# EasyEDA Pro project ProPrj_赛博沙漏彩砂版二代（完全开源）_2025-03-31.epro, board 主控3030
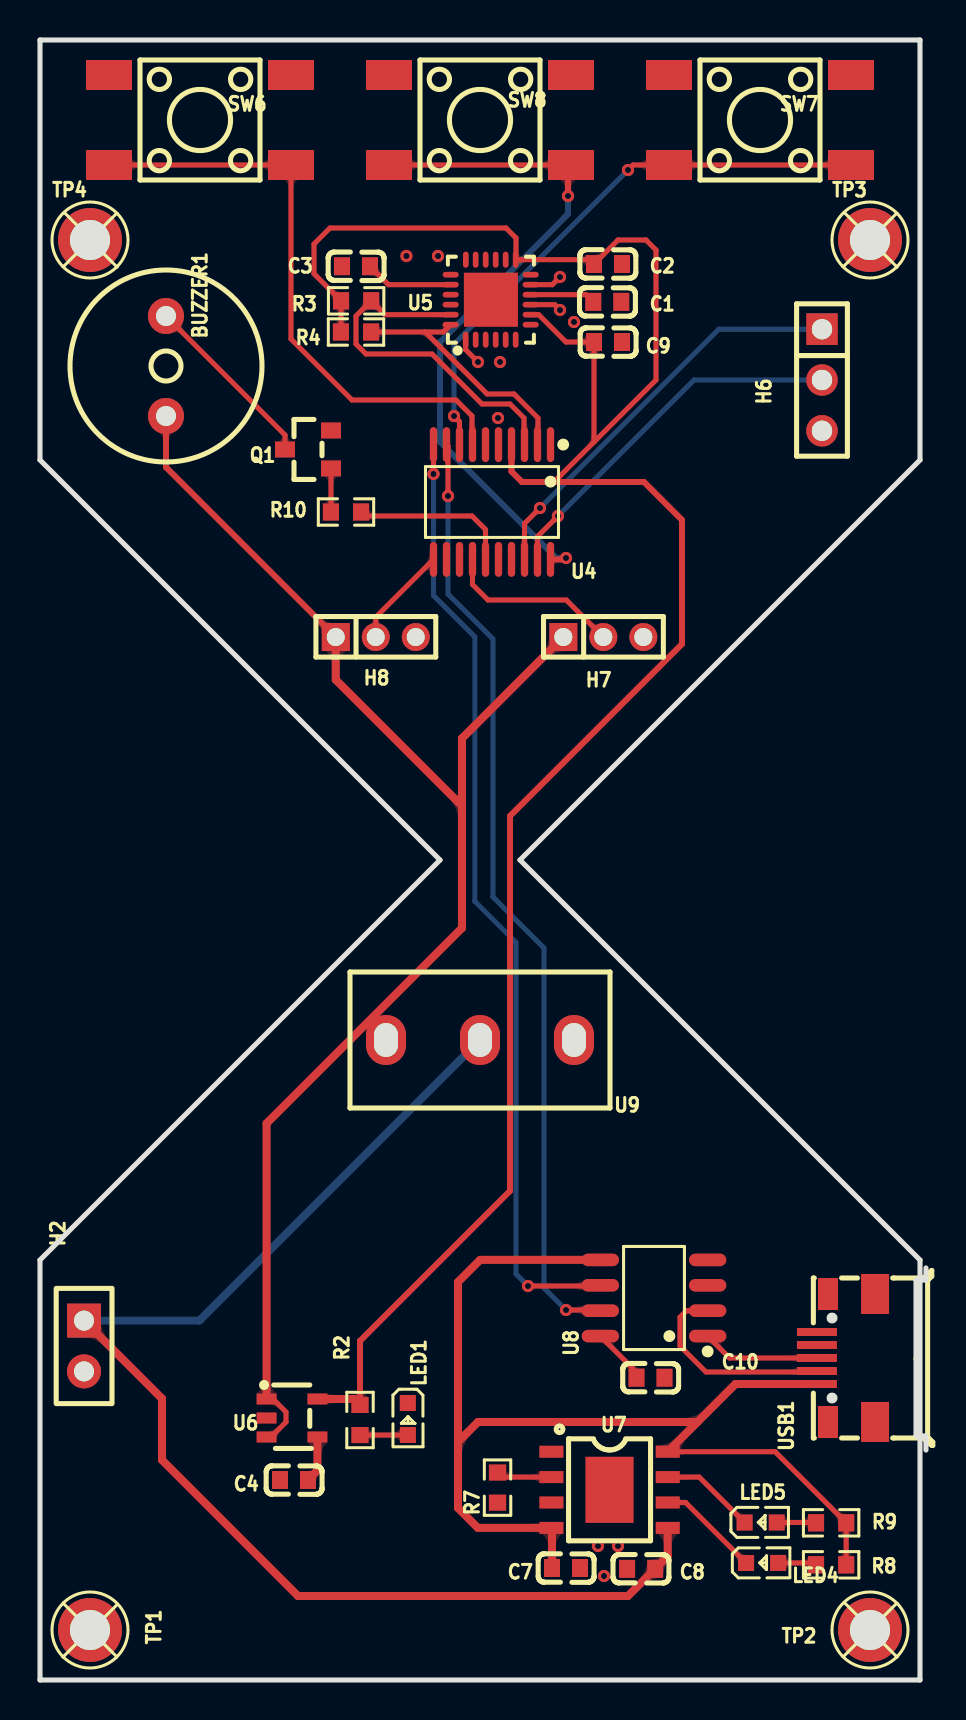
[diagram p2: board, top side]
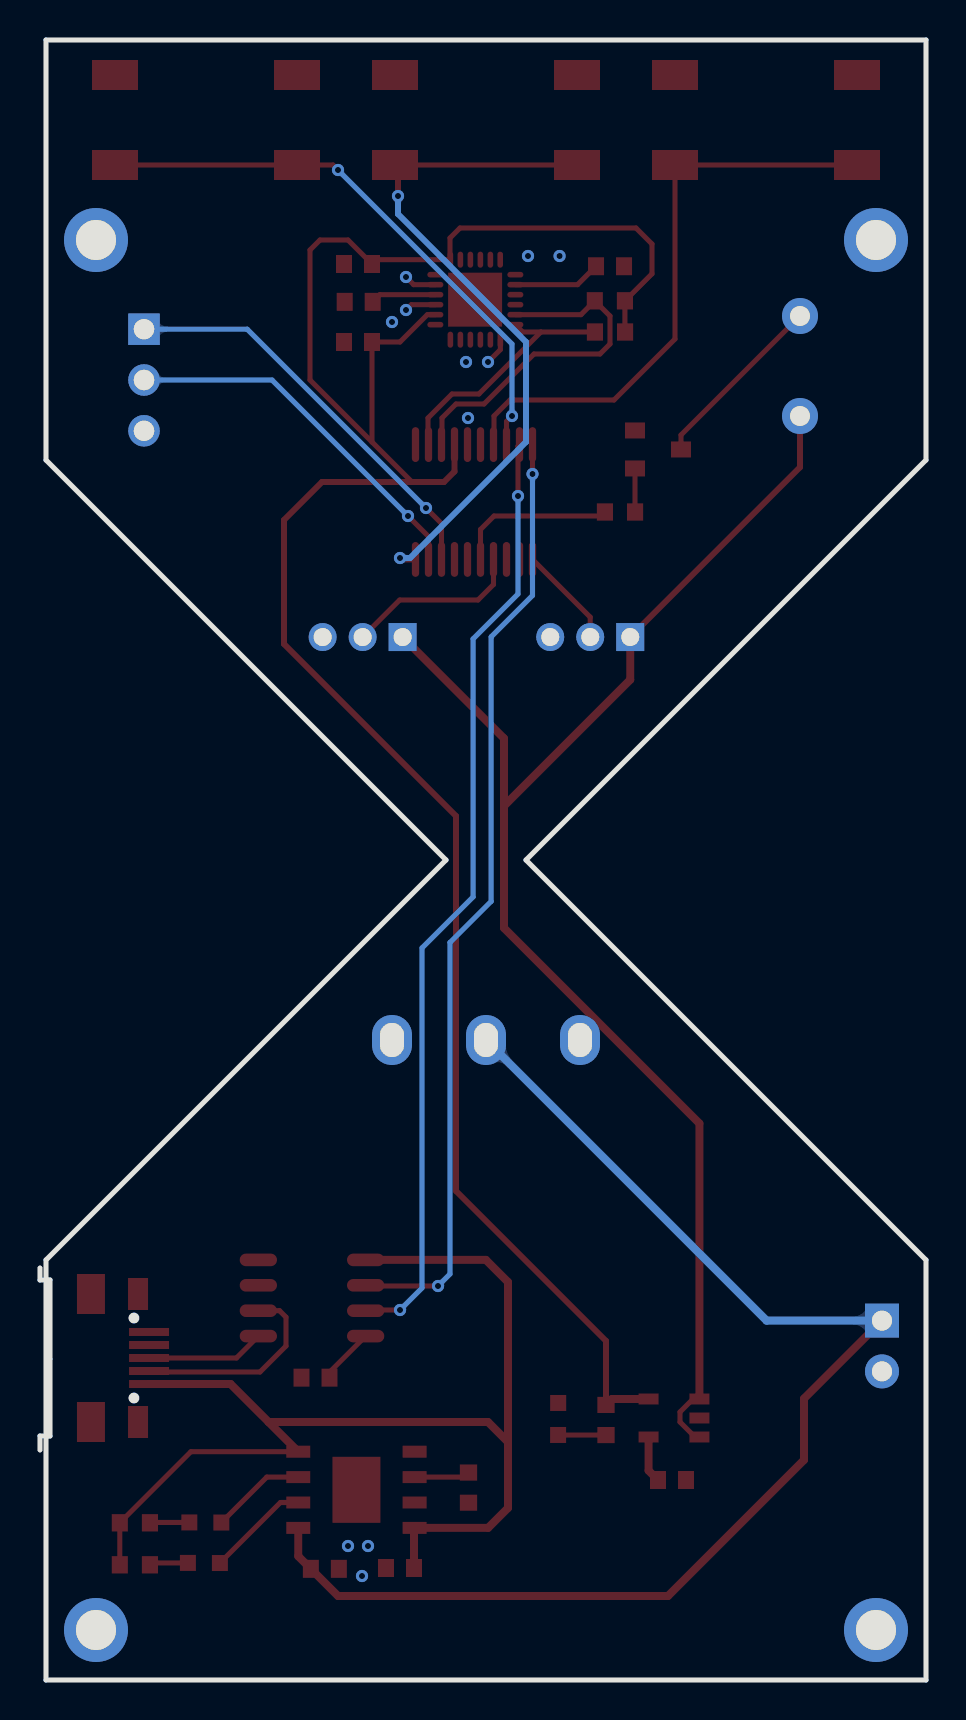
[diagram p3: board, bottom side, seen from below]

Outline 44.3 x 82 mm; copper layers: Top Layer, Bottom Layer. Coordinates in mm from the lower left corner of the outline.
Outline path: 0,82 0,61 20,41 0,21 0,0 44,0 44,21 24,41 44,61 44,82 0,82
Stack: Top Layer 0.035mm / Dielectric1 1.51mm FR4 er 4.5 / Bottom Layer 0.035mm

## Design rules (mm)
template: JLCPCB Capability(Two Layers Board)
spacing copperThickness1oz (default): track to track 0.102, other pairs 0.152 to 0.3
spacing copperThickness2oz: track to track 0.203, other pairs 0.152 to 0.3
track width copperThickness1oz (default): min 0.127, default 0.254, max 2.54
track width copperThickness2oz: min 0.203, default 0.254, max 2.54
differential pair differentialPair (default): width min 0.127, default 0.254, max 2.54; gap min 0.152, default 0.152
via viaSize (default): diameter min 0.5, default 0.61, max 10; hole min 0.3, default 0.305, max 6.3

## Placement (name value [footprint] x y rotation side)
BUZZER1  3000Hz  [BUZ-TH_BD9.6-P5.00-D0.7-FD]  6.3 65.7 90 top
C1  100nF  [C0603]  28.37 68.91 180 top
C2  100nF  [C0603]  28.4 70.8 0 top
C3  2.2nF  [C0603]  15.8 70.69 180 top
C4  470pF  [C0603]  12.7 10 180 top
C7  10uF  [C0603]  26.3 5.6 180 top
C8  10uF  [C0603]  30.06 5.56 0 top
C9  100nF  [C0603]  28.4 66.9 180 top
C10  100nF  [C0603]  30.53 15.12 180 top
H2  -  [HDR-TH_2P-P2.54-V-F]  2.2 16.7 270 top
H6  -  [HDR-TH_3P-P2.54-V-F]  39.1 65 270 top
H7  PZ200-1-03-Z  [HDR-TH_3P-P2.00-V-M]  28.17 52.15 0 top
H8  PZ200-1-03-Z  [HDR-TH_3P-P2.00-V-M]  16.79 52.15 0 top
LED1  -  [LED_0603]  18.4 13 270 top
LED4  -  [LED_0603]  36.16 5.86 0 top
LED5  -  [LED_0603]  36.08 7.88 0 top
Q1  -  [S8050_SOT-23]  13.4 61.4 0 top
R2  1K  [R0603]  16 13 270 top
R3  10K  [R0603]  15.81 68.96 180 top
R4  10K  [R0603]  15.8 67.4 180 top
R7  1.2K  [R0603]  22.88 9.62 90 top
R8  10K  [R0603]  39.56 5.76 180 top
R9  10K  [R0603]  39.56 7.86 180 top
R10  1K  [R0603]  15.3 58.4 180 top
SW6  -  [SW-SMD_4P-L6.0-W6.0-P4.50-LS9.0-2]  8 78 180 top
SW7  -  [SW-SMD_4P-L6.0-W6.0-P4.50-LS9.0-2]  36 78 180 top
SW8  -  [SW-SMD_4P-L6.0-W6.0-P4.50-LS9.0-2]  22 78 180 top
TP1  -  [m2螺丝]  2.5 2.5 270 top
TP2  -  [m2螺丝]  41.5 2.5 0 top
TP3  -  [m2螺丝]  41.5 72 0 top
TP4  -  [m2螺丝]  2.5 72 0 top
U4  STM32G030F6P6TR  [TSSOP-20_L6.5-W4.4-P0.65-LS6.4-BL]  22.6 58.9 180 top
U5  MPU-6050  [QFN-24_L4.0-W4.0-P0.50-BL-EP2.7]  22.53 69.02 0 top
U6  MIC5219YM5-TR  [SOT-23-5_L3.0-W1.7-P0.95-LS2.8-TL]  12.6 13.1 0 top
U7  TP4056  [ESOP-8_L4.9-W3.9-P1.27-LS6.0-BL-EP]  28.48 9.51 270 top
U8  CH340N  [SOP-8_L4.9-W3.9-P1.27-LS6.0-BL]  30.7 19.1 90 top
U9  SS-12D10G8R  [SW-TH_XKB_SS-12D10G8R]  22 32 180 top
USB1  MicroQTJ  [MICRO-USB-SMD_MICROQTJ]  40.3 16.1 90 top

## Footprints (pads in the part's own frame, mm; a bottom-side part is the same pattern mirrored in y, then rotated)
BUZ-TH_BD9.6-P5.00-D0.7-FD
  round 1.8 hole 1: 1(-2.5,0) 2(2.5,0)
C0603
  rect 0.8x0.9 smd: 1(-0.7,0) 2(0.7,0)
ESOP-8_L4.9-W3.9-P1.27-LS6.0-BL-EP
  rect 0.6x1.2 smd: 1(-1.905,-2.909) 2(-0.635,-2.909) 3(0.635,-2.909) 4(1.905,-2.909) 5(1.905,2.909) 6(0.635,2.909) 7(-0.635,2.909) 8(-1.905,2.909)
  rect 3.3x2.4 smd: 9(0,0)
HDR-TH_2P-P2.54-V-F
  rect 1.7x1.7 hole 1: 1(-1.27,0)
  round 1.7 hole 1: 2(1.27,0)
HDR-TH_3P-P2.00-V-M
  rect 1.4x1.4 hole 0.9: 1(-2,0)
  round 1.4 hole 0.9: 2(0,0) 3(2,0)
HDR-TH_3P-P2.54-V-F
  rect 1.575x1.575 hole 1.02: 1(-2.54,0)
  round 1.575 hole 1.02: 2(0,0) 3(2.54,0)
LED_0603
  rect 0.8x0.8 smd: 1(-0.851,-0.01) 2(0.75,-0.005)
m2螺丝
  round 3.2 hole 2: 1(0,0)
MICRO-USB-SMD_MICROQTJ
  rect 0.4x2 smd: 1(-1.3,1.452) 2(-0.65,1.452) 3(0,1.452) 4(0.65,1.452) 5(1.3,1.452)
  rect 1.6x1 smd: 6(-3.2,0.901) 9(3.2,0.901)
  rect 2x1.4 smd: 7(-3.2,-1.452) 8(3.2,-1.452)
QFN-24_L4.0-W4.0-P0.50-BL-EP2.7
  oval 0.28x0.8 smd: 1(-1.25,-2) 2(-0.75,-2) 3(-0.25,-2) 4(0.25,-2) 5(0.75,-2) 6(1.25,-2) 13(1.25,2) 14(0.75,2) 15(0.25,2) 16(-0.25,2) 17(-0.75,2) 18(-1.242,2)
  oval 0.8x0.28 smd: 7(2,-1.25) 8(2,-0.75) 9(2,-0.25) 10(2,0.25) 11(2,0.75) 12(2,1.25) 19(-2,1.25) 20(-2,0.75) 21(-2,0.25) 22(-2,-0.25) 23(-2,-0.75) 24(-2,-1.25)
  rect 2.7x2.7 smd: 25(0.013,0)
R0603
  rect 0.806x0.864 smd: 1(-0.753,0) 2(0.753,0)
S8050_SOT-23
  rect 1x0.8 smd: 1(1.15,-0.823) 2(1.15,1.077) 3(-1.15,0.127)
SOP-8_L4.9-W3.9-P1.27-LS6.0-BL
  oval 0.63x1.865 smd: 1(-1.905,-2.683) 2(-0.635,-2.683) 3(0.635,-2.683) 4(1.905,-2.683) 5(1.905,2.683) 6(0.635,2.683) 7(-0.635,2.683) 8(-1.905,2.683)
SOT-23-5_L3.0-W1.7-P0.95-LS2.8-TL
  rect 1x0.55 smd: 1(-1.272,0.95) 2(-1.272,0) 3(-1.272,-0.95) 4(1.272,-0.95) 5(1.272,0.95)
SW-SMD_4P-L6.0-W6.0-P4.50-LS9.0-2
  rect 2.3x1.5 smd: 1(-4.55,2.25) 2(4.55,2.25) 3(-4.55,-2.25) 4(4.55,-2.25)
SW-TH_XKB_SS-12D10G8R
  oval 2x2.5 hole 1.2x1.7: 1(-4.7,0) 2(0,0) 3(4.7,0)
TSSOP-20_L6.5-W4.4-P0.65-LS6.4-BL
  oval 0.364x1.742 smd: 1(-2.925,-2.871) 2(-2.275,-2.871) 3(-1.625,-2.871) 4(-0.975,-2.871) 5(-0.325,-2.871) 6(0.325,-2.871) 7(0.975,-2.871) 8(1.625,-2.871) 9(2.275,-2.871) 10(2.925,-2.871) 11(2.925,2.871) 12(2.275,2.871) 13(1.625,2.871) 14(0.975,2.871) 15(0.325,2.871) 16(-0.325,2.871) 17(-0.975,2.871) 18(-1.625,2.871) 19(-2.275,2.871) 20(-2.925,2.871)

## Nets
As in the schematic.

Pads without a net: TP1 1; TP2 1; TP3 1; TP4 1; U4 6 12 13 17; U5 2 3 4 5 6 7 12 14 15 16 17 19 21 22 25; U7 9; U8 4; U9 1; USB1 4 6 7 8 9

## Via types
v1: diameter 0.61, hole 0.305, Top Layer to Bottom Layer, 21 vias

## Routing (per net, layer and track width the routed paths; a pad name or vN(x,y) marks a point on that pad's centre or on a via; arc(x,y) is an arc through that point)
3.3V: length 111.1
  Top Layer w0.254: R4.2 15.05,67.41 15.05,68.96 13.7,70.31 13.7,71.8 14.5,72.6 23.3,72.6 23.8,72.1 23.8,71.03 U5.13 27.48,71.02 ; 27.48,71.02 C2.1 ; 27.48,71.02 27.92,71.02 28.9,72 30.3,72 30.8,71.5 30.8,65 27.7,61.9 ; 27.7,61.9 C9.2 26.3,66.9 24.93,68.27 U5.8 ; 27.7,61.9 25.7,59.9
  Top Layer w0.3: U4.4 23.57,60.42 24.1,59.9 30.2,59.9 32.1,58 32.1,51.8 23.5,43.2 23.5,24.45 16,16.95 R2.1
  Top Layer w0.4: U6.5 15.7,14.05 R2.1
5V: length 72.9
  Top Layer w0.254: U6.3 11.55,12.15 12.3,12.9 12.3,13.4 11.65,14.05 U6.1
  Top Layer w0.3: BUZZER1.1 6.3,60.64 H8.1
  Top Layer w0.4: H7.1 21.1,47.08 21.1,43.7 ; 21.1,43.7 14.79,50.01 H8.1 ; 21.1,43.7 21.1,37.6 11.33,27.83 U6.1
GND: length 4.6
  Top Layer w0.254: U5.9 25.73,68.77 v1(26,68.5) ; U5.11 25.62,69.77 v1(26,70.15) ; v1(21.9,65.9) 21.28,66.52 U5.1
  vias: v1(18.32,71.2) v1(19.9,71.2) v1(22.9,63.1) v1(23,65.9) v1(26.7,67.9) v1(27.9,6.7) v1(28.2,5.2) v1(28.9,6.7)
VBUS: length 59.7
  Top Layer w0.254: U7.8 36.75,11.41 R9.1 R8.1
  Top Layer w0.4: 32.87,12.9 34.77,14.8 USB1.1 ; 32.87,12.9 U7.8 ; 32.87,12.9 21.9,12.9 20.9,11.9 ; 20.9,11.9 20.9,8.6 21.9,7.6 U7.4 25.6,7.57 C7.2 ; 20.9,11.9 20.9,19.9 22,21 U8.5
BAT: length 64.5
  Top Layer w0.4: U7.5 31.39,6.19 C8.2 29.4,4.2 12.9,4.2 6.1,11 6.1,14.07 H2.1
  Bottom Layer w0.4: U9.2 7.97,17.97 H2.1
BEEP: length 8.1
  Top Layer w0.254: R10.1 16.25,58.2 21.6,58.2 22.28,57.53 22.28,56.03
D+: length 5.9
  Top Layer w0.254: USB1.3 34.48,16.1 U8.1
D-: length 10.3
  Top Layer w0.254: U8.2 32.32,18.47 32,18.14 32,16.7 33.3,15.4 38.8,15.4
L+: length 29.9
  Top Layer w0.254: SW6.2 SW6.1 12.55,67.05 15.6,64 20.8,64 21.6,63.2 21.6,61.8 U4.7
L-: length 28.7
  Top Layer w0.254: v1(20.7,63.2) 20.97,62.92 U4.8 ; SW7.1 SW7.2 29.65,75.75 v1(29.4,75.5)
  Bottom Layer w0.254: v1(29.4,75.5) 20.7,66.8 v1(20.7,63.2)
RX: length 47.7
  Top Layer w0.254: v1(24.4,19.7) 27.98,19.7 28.02,19.74 ; 19.68,61.77 v1(19.68,60.3)
  Bottom Layer w0.254: v1(24.4,19.7) 23.8,20.3 23.8,36.87 21.74,38.93 21.74,52.16 19.68,54.22 v1(19.68,60.3)
SCL: length 18
  Top Layer w0.254: U5.23 17.25,68.27 R3.1 15.8,68.2 15.8,66.8 16.3,66.3 19.6,66.3 22.1,63.8 23.5,63.8 24.2,63.1 24.2,61.8 U4.3
SDA: length 12.9
  Top Layer w0.254: R4.1 19.26,67.4 ; 19.26,67.4 22.36,64.3 23.7,64.3 24.9,63.1 24.9,61.8 U4.2 ; 19.26,67.4 20.17,67.4 U5.24
SPI1_MO: length 8.9
  Top Layer w0.254: 21.62,56.03 21.62,54.78 22.4,54 26.32,54 H7.2
SPI2_MO: length 5.1
  Top Layer w0.254: 19.68,56.03 16.79,53.14 H8.2
SWCK: length 18.6
  Top Layer w0.254: 24.88,56.03 24.88,57.17 v1(25.9,58.2)
  Bottom Layer w0.254: H6.2 32.7,65 v1(25.9,58.2)
SWIO: length 20.7
  Top Layer w0.254: v1(25,58.6) 24.22,57.83 24.22,56.03
  Bottom Layer w0.254: H6.1 33.94,67.54 v1(25,58.6)
T+: length 35.2
  Top Layer w0.254: SW8.1 SW8.2
  Top Layer w0.3: v1(26.3,56.1) 26.23,56.03 25.53,56.03 ; v1(26.4,74.2) 26.4,75.6 SW8.1
  Bottom Layer w0.3: v1(26.3,56.1) 25.8,56.1 20,61.9 20,66.9 26.4,73.3 v1(26.4,74.2)
TX: length 47.5
  Top Layer w0.254: v1(20.4,59.2) 20.4,61.7 U4.9 ; U8.7 27.98,18.5 v1(26.3,18.5)
  Bottom Layer w0.254: v1(20.4,59.2) 20.4,54.3 22.65,52.06 22.65,39.16 25.2,36.6 25.2,19.6 v1(26.3,18.5)
$1N1404: length 2.4
  Top Layer w0.254: R2.2 18.39,12.25 LED1.2
$1N1449: length 3.3
  Top Layer w0.254: 27.66,68.91 27.31,69.27 U5.10
$1N1455: length 4.4
  Top Layer w0.254: C3.1 17.42,69.77 U5.20
$1N1464: length 2.3
  Top Layer w0.4: U6.4 13.87,10.47 C4.1
$1N1498: length 2.8
  Top Layer w0.254: R7.2 23.1,10.15 U7.2
$1N1499: length 1.8
  Top Layer w0.254: LED4.2 38.71,5.85
$1N1500: length 2
  Top Layer w0.254: LED5.2 38.78,7.88
$1N1501: length 5.2
  Top Layer w0.254: 35.31,5.85 32.28,8.88 U7.6
$1N1502: length 4.8
  Top Layer w0.254: 35.23,7.87 32.96,10.15 U7.7
$1N1507: length 2.2
  Top Layer w0.254: 14.55,60.58 14.55,58.4 R10.2
$1N1508: length 9.1
  Top Layer w0.254: Q1.3 12.25,62.25 BUZZER1.2
$1N2510: length 2.8
  Top Layer w0.254: U8.8 29.82,15.39 29.82,15.12

## Copper pours and planes (outline as drawn; the poured copper is in the pictures)
GND on Top Layer: -4.3,82.1 48.7,82.1 48.7,-0.3 -4.3,-0.3
GND on Bottom Layer: -2,82.2 46,82.2 46,0 -2,0

Small or netless copper shapes (teardrops, artwork), in the pictures only: 114 on Top Layer, 14 on Bottom Layer
